# Altium schematic sheet P[04]_CPU_POWER.SchDoc
size 513 x 386 mm
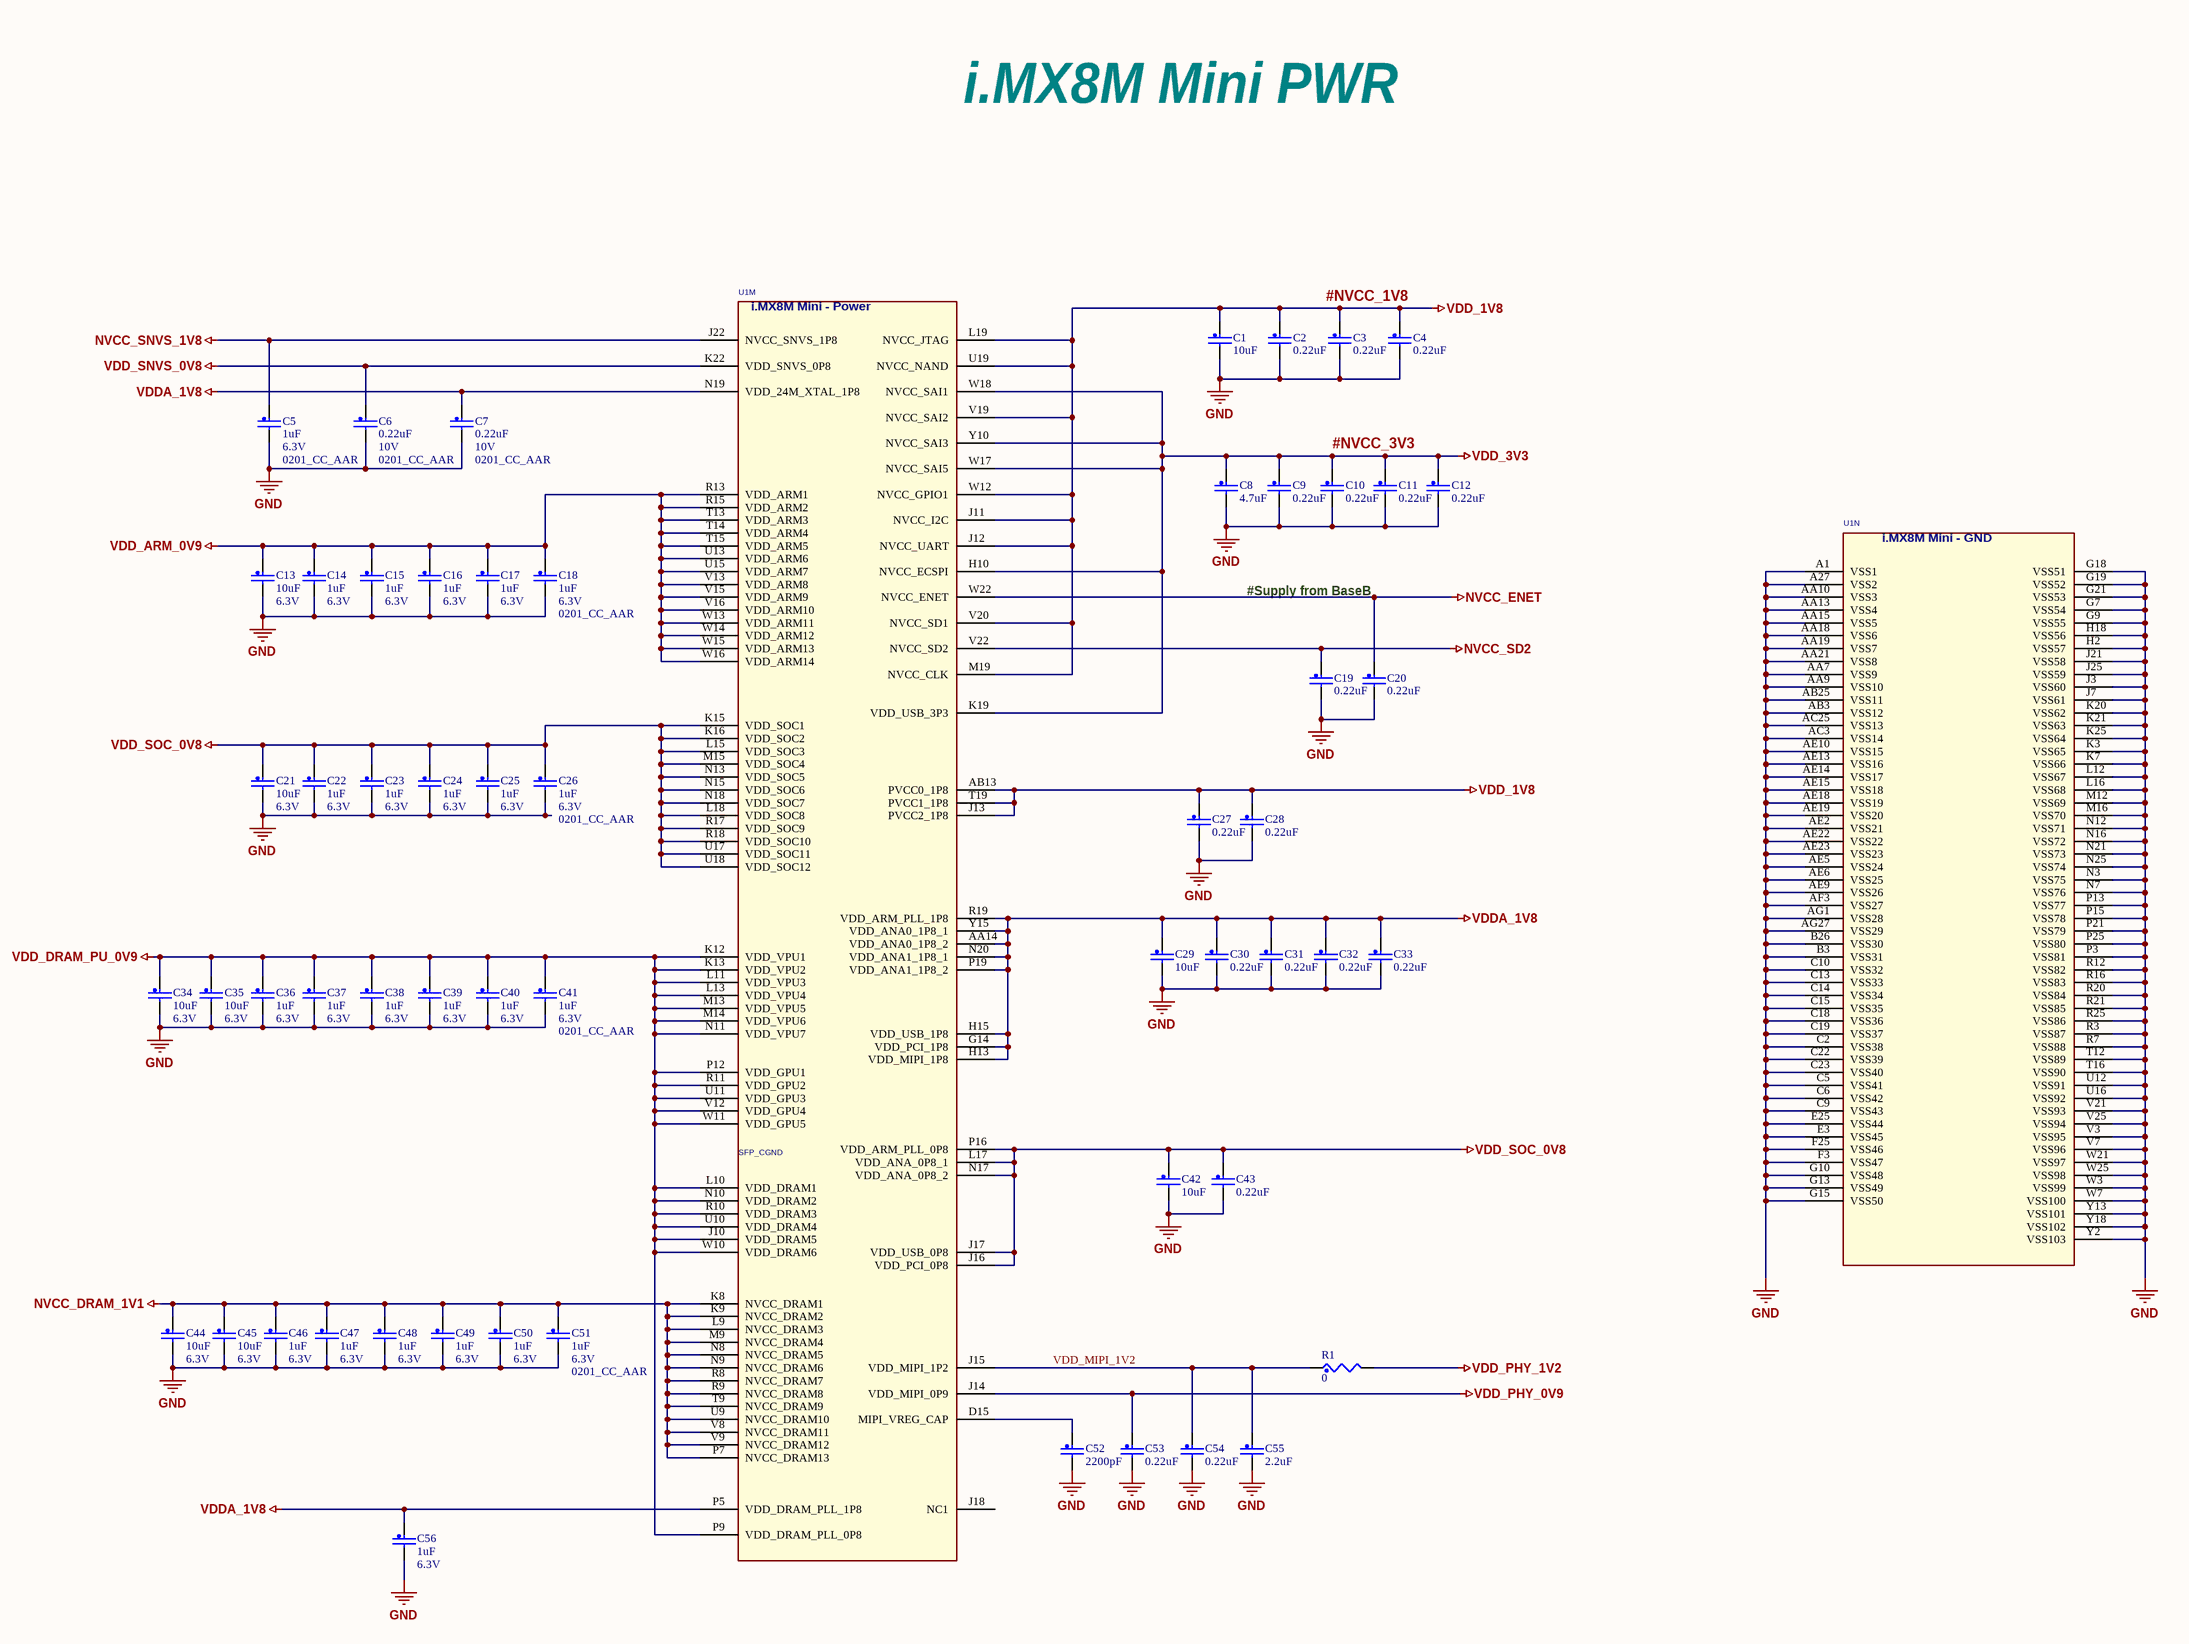
[diagram p0: P[04]_CPU_POWER.SchDoc]

## Parts
C1  10uF  [0402_CC - C]
C2  0.22uF  [0201_CC - C]
C3  0.22uF  [0201_CC - C]
C4  0.22uF  [0201_CC - C]
C5  1uF  Voltage: 6.3V  footprint: 0201_CC_AAR  [0201_CC - C]
C6  0.22uF  Voltage: 10V  footprint: 0201_CC_AAR  [0201_CC - C]
C7  0.22uF  Voltage: 10V  footprint: 0201_CC_AAR  [0201_CC - C]
C8  4.7uF  [0402_CC - C]
C9  0.22uF  [0201_CC - C]
C10  0.22uF  [0201_CC - C]
C11  0.22uF  [0201_CC - C]
C12  0.22uF  [0201_CC - C]
C13  10uF  Voltage: 6.3V  [0402_CC - C]
C14  1uF  Voltage: 6.3V  [0201_CC - C]
C15  1uF  Voltage: 6.3V  [0201_CC - C]
C16  1uF  Voltage: 6.3V  [0201_CC - C]
C17  1uF  Voltage: 6.3V  [0201_CC - C]
C18  1uF  Voltage: 6.3V  footprint: 0201_CC_AAR  [0201_CC - C]
C19  0.22uF  [0201_CC - C]
C20  0.22uF  [0201_CC - C]
C21  10uF  Voltage: 6.3V  [0402_CC - C]
C22  1uF  Voltage: 6.3V  [0201_CC - C]
C23  1uF  Voltage: 6.3V  [0201_CC - C]
C24  1uF  Voltage: 6.3V  [0201_CC - C]
C25  1uF  Voltage: 6.3V  [0201_CC - C]
C26  1uF  Voltage: 6.3V  footprint: 0201_CC_AAR  [0201_CC - C]
C27  0.22uF  [0201_CC - C]
C28  0.22uF  [0201_CC - C]
C29  10uF  [0402_CC - C]
C30  0.22uF  [0201_CC - C]
C31  0.22uF  [0201_CC - C]
C32  0.22uF  [0201_CC - C]
C33  0.22uF  [0201_CC - C]
C34  10uF  Voltage: 6.3V  [0402_CC - C]
C35  10uF  Voltage: 6.3V  [0402_CC - C]
C36  1uF  Voltage: 6.3V  [0201_CC - C]
C37  1uF  Voltage: 6.3V  [0201_CC - C]
C38  1uF  Voltage: 6.3V  [0201_CC - C]
C39  1uF  Voltage: 6.3V  [0201_CC - C]
C40  1uF  Voltage: 6.3V  [0201_CC - C]
C41  1uF  Voltage: 6.3V  footprint: 0201_CC_AAR  [0201_CC - C]
C42  10uF  [0402_CC - C]
C43  0.22uF  [0201_CC - C]
C44  10uF  Voltage: 6.3V  [0402_CC - C]
C45  10uF  Voltage: 6.3V  [0402_CC - C]
C46  1uF  Voltage: 6.3V  [0201_CC - C]
C47  1uF  Voltage: 6.3V  [0201_CC - C]
C48  1uF  Voltage: 6.3V  [0201_CC - C]
C49  1uF  Voltage: 6.3V  [0201_CC - C]
C50  1uF  Voltage: 6.3V  [0201_CC - C]
C51  1uF  Voltage: 6.3V  footprint: 0201_CC_AAR  [0201_CC - C]
C52  2200pF  [0201_CC - C]
C53  0.22uF  [0201_CC - C]
C54  0.22uF  [0201_CC - C]
C55  2.2uF  [0402_CC - C]
C56  1uF  Voltage: 6.3V  [0201_CC - C]
R1  0  [0402_CC]
U1  SFP_CGND  [BGA486_0P5_14X14]  (parts M,N of 14)

## Nets
GND: C1.2 C2.2 C3.2 C4.2 C5.2 C6.2 C7.2 C8.2 C9.2 C10.2 C11.2 C12.2 C13.2 C14.2 C15.2 C16.2 C17.2 C18.2 C19.2 C20.2 C21.2 C22.2 C23.2 C24.2 C25.2 C26.2 C27.2 C28.2 C29.2 C30.2 C31.2 C32.2 C33.2 C34.2 C35.2 C36.2 C37.2 C38.2 C39.2 C40.2 C41.2 C42.2 C43.2 C44.2 C45.2 C46.2 C47.2 C48.2 C49.2 C50.2 C51.2 C52.2 C53.2 C54.2 C55.2 C56.2 U1.A1(VSS1) U1.A27(VSS2) U1.AA7(VSS9) U1.AA9(VSS10) U1.AA10(VSS3) U1.AA13(VSS4) U1.AA15(VSS5) U1.AA18(VSS6) U1.AA19(VSS7) U1.AA21(VSS8) U1.AB3(VSS12) U1.AB25(VSS11) U1.AC3(VSS14) U1.AC25(VSS13) U1.AE2(VSS21) U1.AE5(VSS24) U1.AE6(VSS25) U1.AE9(VSS26) U1.AE10(VSS15) U1.AE13(VSS16) U1.AE14(VSS17) U1.AE15(VSS18) U1.AE18(VSS19) U1.AE19(VSS20) U1.AE22(VSS22) U1.AE23(VSS23) U1.AF3(VSS27) U1.AG1(VSS28) U1.AG27(VSS29) U1.B3(VSS31) U1.B26(VSS30) U1.C2(VSS38) U1.C5(VSS41) U1.C6(VSS42) U1.C9(VSS43) U1.C10(VSS32) U1.C13(VSS33) U1.C14(VSS34) U1.C15(VSS35) U1.C18(VSS36) U1.C19(VSS37) U1.C22(VSS39) U1.C23(VSS40) U1.E3(VSS45) U1.E25(VSS44) U1.F3(VSS47) U1.F25(VSS46) U1.G7(VSS54) U1.G9(VSS55) U1.G10(VSS48) U1.G13(VSS49) U1.G15(VSS50) U1.G18(VSS51) U1.G19(VSS52) U1.G21(VSS53) U1.H2(VSS57) U1.H18(VSS56) U1.J3(VSS60) U1.J7(VSS61) U1.J21(VSS58) U1.J25(VSS59) U1.K3(VSS65) U1.K7(VSS66) U1.K20(VSS62) U1.K21(VSS63) U1.K25(VSS64) U1.L12(VSS67) U1.L16(VSS68) U1.M12(VSS69) U1.M16(VSS70) U1.N3(VSS75) U1.N7(VSS76) U1.N12(VSS71) U1.N16(VSS72) U1.N21(VSS73) U1.N25(VSS74) U1.P3(VSS81) U1.P13(VSS77) U1.P15(VSS78) U1.P21(VSS79) U1.P25(VSS80) U1.R3(VSS87) U1.R7(VSS88) U1.R12(VSS82) U1.R16(VSS83) U1.R20(VSS84) U1.R21(VSS85) U1.R25(VSS86) U1.T12(VSS89) U1.T16(VSS90) U1.U12(VSS91) U1.U16(VSS92) U1.V3(VSS95) U1.V7(VSS96) U1.V21(VSS93) U1.V25(VSS94) U1.W3(VSS99) U1.W7(VSS100) U1.W21(VSS97) U1.W25(VSS98) U1.Y2(VSS103) U1.Y13(VSS101) U1.Y18(VSS102)
NVCC_DRAM_1V1: C44.1 C45.1 C46.1 C47.1 C48.1 C49.1 C50.1 C51.1 U1.K8(NVCC_DRAM1) U1.K9(NVCC_DRAM2) U1.L9(NVCC_DRAM3) U1.M9(NVCC_DRAM4) U1.N8(NVCC_DRAM5) U1.N9(NVCC_DRAM6) U1.P7(NVCC_DRAM13) U1.R8(NVCC_DRAM7) U1.R9(NVCC_DRAM8) U1.T9(NVCC_DRAM9) U1.U9(NVCC_DRAM10) U1.V8(NVCC_DRAM11) U1.V9(NVCC_DRAM12)
NVCC_ENET: C20.1 U1.W22(NVCC_ENET)
NVCC_SD2: C19.1 U1.V22(NVCC_SD2)
NVCC_SNVS_1V8: C5.1 U1.J22(NVCC_SNVS_1P8)
VDD_1V8: C1.1 C2.1 C3.1 C4.1 C27.1 C28.1 U1.AB13(PVCC0_1P8) U1.J11(NVCC_I2C) U1.J12(NVCC_UART) U1.J13(PVCC2_1P8) U1.L19(NVCC_JTAG) U1.M19(NVCC_CLK) U1.T19(PVCC1_1P8) U1.U19(NVCC_NAND) U1.V19(NVCC_SAI2) U1.V20(NVCC_SD1) U1.W12(NVCC_GPIO1)
VDD_3V3: C8.1 C9.1 C10.1 C11.1 C12.1 U1.H10(NVCC_ECSPI) U1.K19(VDD_USB_3P3) U1.W17(NVCC_SAI5) U1.W18(NVCC_SAI1) U1.Y10(NVCC_SAI3)
VDD_ARM_0V9: C13.1 C14.1 C15.1 C16.1 C17.1 C18.1 U1.R13(VDD_ARM1) U1.R15(VDD_ARM2) U1.T13(VDD_ARM3) U1.T14(VDD_ARM4) U1.T15(VDD_ARM5) U1.U13(VDD_ARM6) U1.U15(VDD_ARM7) U1.V13(VDD_ARM8) U1.V15(VDD_ARM9) U1.V16(VDD_ARM10) U1.W13(VDD_ARM11) U1.W14(VDD_ARM12) U1.W15(VDD_ARM13) U1.W16(VDD_ARM14)
VDD_DRAM_PU_0V9: C34.1 C35.1 C36.1 C37.1 C38.1 C39.1 C40.1 C41.1 U1.J10(VDD_DRAM5) U1.K12(VDD_VPU1) U1.K13(VDD_VPU2) U1.L10(VDD_DRAM1) U1.L11(VDD_VPU3) U1.L13(VDD_VPU4) U1.M13(VDD_VPU5) U1.M14(VDD_VPU6) U1.N10(VDD_DRAM2) U1.N11(VDD_VPU7) U1.P9(VDD_DRAM_PLL_0P8) U1.P12(VDD_GPU1) U1.R10(VDD_DRAM3) U1.R11(VDD_GPU2) U1.U10(VDD_DRAM4) U1.U11(VDD_GPU3) U1.V12(VDD_GPU4) U1.W10(VDD_DRAM6) U1.W11(VDD_GPU5)
VDD_PHY_0V9: C53.1 U1.J14(VDD_MIPI_0P9)
VDD_PHY_1V2: R1.2
VDD_SNVS_0V8: C6.1 U1.K22(VDD_SNVS_0P8)
VDD_SOC_0V8: C21.1 C22.1 C23.1 C24.1 C25.1 C26.1 C42.1 C43.1 U1.J16(VDD_PCI_0P8) U1.J17(VDD_USB_0P8) U1.K15(VDD_SOC1) U1.K16(VDD_SOC2) U1.L15(VDD_SOC3) U1.L17(VDD_ANA_0P8_1) U1.L18(VDD_SOC8) U1.M15(VDD_SOC4) U1.N13(VDD_SOC5) U1.N15(VDD_SOC6) U1.N17(VDD_ANA_0P8_2) U1.N18(VDD_SOC7) U1.P16(VDD_ARM_PLL_0P8) U1.R17(VDD_SOC9) U1.R18(VDD_SOC10) U1.U17(VDD_SOC11) U1.U18(VDD_SOC12)
VDDA_1V8: C7.1 C29.1 C30.1 C31.1 C32.1 C33.1 C56.1 U1.AA14(VDD_ANA0_1P8_2) U1.G14(VDD_PCI_1P8) U1.H13(VDD_MIPI_1P8) U1.H15(VDD_USB_1P8) U1.N19(VDD_24M_XTAL_1P8) U1.N20(VDD_ANA1_1P8_1) U1.P5(VDD_DRAM_PLL_1P8) U1.P19(VDD_ANA1_1P8_2) U1.R19(VDD_ARM_PLL_1P8) U1.Y15(VDD_ANA0_1P8_1)
VDD_MIPI_1V2: C54.1 C55.1 R1.1 U1.J15(VDD_MIPI_1P2)
NetC52_1: C52.1 U1.D15(MIPI_VREG_CAP)

Not connected (* = marked no-connect by the designer): U1 J18(NC1)

## Notes on the sheet
- i.MX8M Mini PWR
- #NVCC_1V8
- #NVCC_3V3
- #Supply from BaseB
- Title
- Size:
- Date:
- A3
- Number:
- Time:
- Revision:
- Sheet
- of
- File:
- (in symbol MIMX8MM_BGA486P, part M) i.MX8M Mini - Power
- (in symbol MIMX8MM_BGA486P, part N) i.MX8M Mini - GND

## Library data of the parts
C1-C56 = CAP_NP: CLASS: DISCRETE
  C13 C21 C34 C35 C44 C45: footprint: 0402_CC_AAR
  C14-C17 C22-C25 C36-C40 C46-C50 C56: footprint: 0201_CC_AAR
R1 = RES: CLASS: DISCRETE
U1 = MIMX8MM_BGA486P: IC CPU QUAD CORTEX A53+M4 1.8GHZ BGA486 / By Arman Arvand; SPLIT_INST: TRUE; CAD_APPROVED: Yes; PRE_APN: 330-77072; MFG_PN01: MIMX8MM6DVTLZAA; MFG_NAME01: NXP SEMICONDUCTORS; AGILE_PN: TMP-WF-32905; CLASS: IC; HEIGHT: 1.25MM; ROHS: Yes